# Altium schematic sheet sDAC_filters_0.SchDoc
size A; SheetNumber: 21; SheetTotal: 24
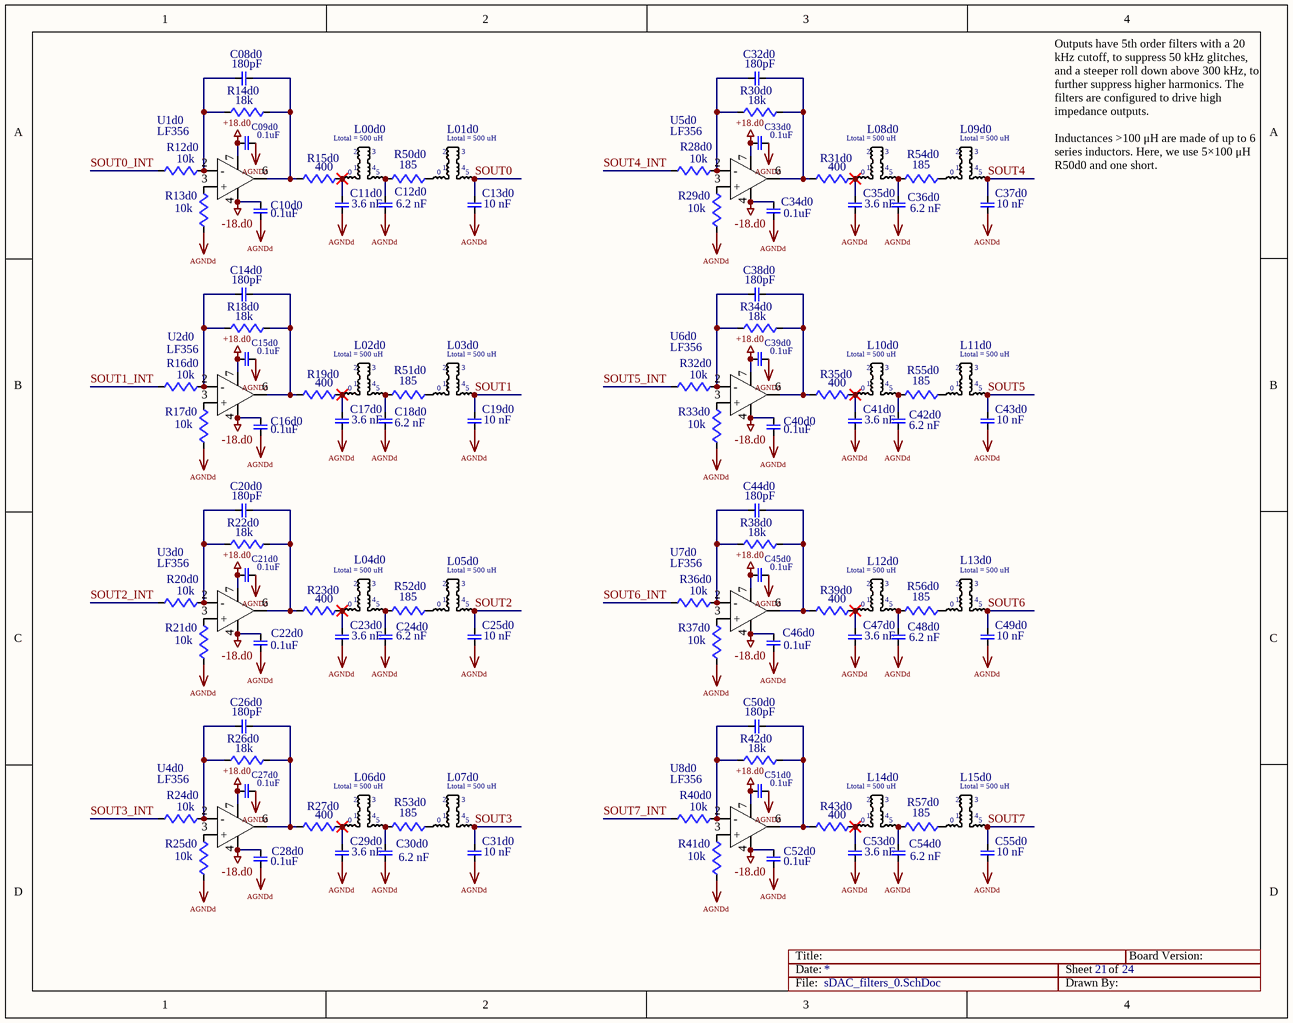
[diagram p0: sDAC_filters_0.SchDoc]

## Parts
C08d0  180pF  [0603]
C09d0  0.1uF  [0603]
C10d0  0.1uF  [0603]
C11d0  3.6 nF  [0603]
C12d0  6.2 nF  [0603]
C13d0  10 nF  [0603]
C14d0  180pF  [0603]
C15d0  0.1uF  [0603]
C16d0  0.1uF  [0603]
C17d0  3.6 nF  [0603]
C18d0  6.2 nF  [0603]
C19d0  10 nF  [0603]
C20d0  180pF  [0603]
C21d0  0.1uF  [0603]
C22d0  0.1uF  [0603]
C23d0  3.6 nF  [0603]
C24d0  6.2 nF  [0603]
C25d0  10 nF  [0603]
C26d0  180pF  [0603]
C27d0  0.1uF  [0603]
C28d0  0.1uF  [0603]
C29d0  3.6 nF  [0603]
C30d0  6.2 nF  [0603]
C31d0  10 nF  [0603]
C32d0  180pF  [0603]
C33d0  0.1uF  [0603]
C34d0  0.1uF  [0603]
C35d0  3.6 nF  [0603]
C36d0  6.2 nF  [0603]
C37d0  10 nF  [0603]
C38d0  180pF  [0603]
C39d0  0.1uF  [0603]
C40d0  0.1uF  [0603]
C41d0  3.6 nF  [0603]
C42d0  6.2 nF  [0603]
C43d0  10 nF  [0603]
C44d0  180pF  [0603]
C45d0  0.1uF  [0603]
C46d0  0.1uF  [0603]
C47d0  3.6 nF  [0603]
C48d0  6.2 nF  [0603]
C49d0  10 nF  [0603]
C50d0  180pF  [0603]
C51d0  0.1uF  [0603]
C52d0  0.1uF  [0603]
C53d0  3.6 nF  [0603]
C54d0  6.2 nF  [0603]
C55d0  10 nF  [0603]
L00d0  Ltotal = 500 uH  [SMT_TOROID_2SIDE]
L01d0  Ltotal = 500 uH  [SMT_TOROID_2SIDE]
L02d0  Ltotal = 500 uH  [SMT_TOROID_2SIDE]
L03d0  Ltotal = 500 uH  [SMT_TOROID_2SIDE]
L04d0  Ltotal = 500 uH  [SMT_TOROID_2SIDE]
L05d0  Ltotal = 500 uH  [SMT_TOROID_2SIDE]
L06d0  Ltotal = 500 uH  [SMT_TOROID_2SIDE]
L07d0  Ltotal = 500 uH  [SMT_TOROID_2SIDE]
L08d0  Ltotal = 500 uH  [SMT_TOROID_2SIDE]
L09d0  Ltotal = 500 uH  [SMT_TOROID_2SIDE]
L10d0  Ltotal = 500 uH  [SMT_TOROID_2SIDE]
L11d0  Ltotal = 500 uH  [SMT_TOROID_2SIDE]
L12d0  Ltotal = 500 uH  [SMT_TOROID_2SIDE]
L13d0  Ltotal = 500 uH  [SMT_TOROID_2SIDE]
L14d0  Ltotal = 500 uH  [SMT_TOROID_2SIDE]
L15d0  Ltotal = 500 uH  [SMT_TOROID_2SIDE]
R12d0  10k  [0603]
R13d0  10k  [0603]
R14d0  18k  [0603]
R15d0  400  [0603]
R16d0  10k  [0603]
R17d0  10k  [0603]
R18d0  18k  [0603]
R19d0  400  [0603]
R20d0  10k  [0603]
R21d0  10k  [0603]
R22d0  18k  [0603]
R23d0  400  [0603]
R24d0  10k  [0603]
R25d0  10k  [0603]
R26d0  18k  [0603]
R27d0  400  [0603]
R28d0  10k  [0603]
R29d0  10k  [0603]
R30d0  18k  [0603]
R31d0  400  [0603]
R32d0  10k  [0603]
R33d0  10k  [0603]
R34d0  18k  [0603]
R35d0  400  [0603]
R36d0  10k  [0603]
R37d0  10k  [0603]
R38d0  18k  [0603]
R39d0  400  [0603]
R40d0  10k  [0603]
R41d0  10k  [0603]
R42d0  18k  [0603]
R43d0  400  [0603]
R50d0  185  [0603]
R51d0  185  [0603]
R52d0  185  [0603]
R53d0  185  [0603]
R54d0  185  [0603]
R55d0  185  [0603]
R56d0  185  [0603]
R57d0  185  [0603]
U1d0  LF356  [8SOIC]
U2d0  LF356  [8SOIC]
U3d0  LF356  [8SOIC]
U4d0  LF356  [8SOIC]
U5d0  LF356  [8SOIC]
U6d0  LF356  [8SOIC]
U7d0  LF356  [8SOIC]
U8d0  LF356  [8SOIC]

## Nets
+18.d0: C09d0.1 C15d0.1 C21d0.1 C27d0.1 C33d0.1 C39d0.1 C45d0.1 C51d0.1 U1d0.7(V+) U2d0.7(V+) U3d0.7(V+) U4d0.7(V+) U5d0.7(V+) U6d0.7(V+) U7d0.7(V+) U8d0.7(V+)
-18.d0: C10d0.1 C16d0.1 C22d0.1 C28d0.1 C34d0.1 C40d0.1 C46d0.1 C52d0.1 U1d0.4(V-) U2d0.4(V-) U3d0.4(V-) U4d0.4(V-) U5d0.4(V-) U6d0.4(V-) U7d0.4(V-) U8d0.4(V-)
AGNDd: C09d0.2 C10d0.2 C11d0.2 C12d0.2 C13d0.2 C15d0.2 C16d0.2 C17d0.2 C18d0.2 C19d0.2 C21d0.2 C22d0.2 C23d0.2 C24d0.2 C25d0.2 C27d0.2 C28d0.2 C29d0.2 C30d0.2 C31d0.2 C33d0.2 C34d0.2 C35d0.2 C36d0.2 C37d0.2 C39d0.2 C40d0.2 C41d0.2 C42d0.2 C43d0.2 C45d0.2 C46d0.2 C47d0.2 C48d0.2 C49d0.2 C51d0.2 C52d0.2 C53d0.2 C54d0.2 C55d0.2 R13d0.1 R17d0.1 R21d0.1 R25d0.1 R29d0.1 R33d0.1 R37d0.1 R41d0.1
SOUT0: C13d0.1 L01d0.7
SOUT0_INT: R12d0.1
SOUT1: C19d0.1 L03d0.7
SOUT1_INT: R16d0.1
SOUT2: C25d0.1 L05d0.7
SOUT2_INT: R20d0.1
SOUT3: C31d0.1 L07d0.7
SOUT3_INT: R24d0.1
SOUT4: C37d0.1 L09d0.7
SOUT4_INT: R28d0.1
SOUT5: C43d0.1 L11d0.7
SOUT5_INT: R32d0.1
SOUT6: C49d0.1 L13d0.7
SOUT6_INT: R36d0.1
SOUT7: C55d0.1 L15d0.7
SOUT7_INT: R40d0.1
NetC08d0_1: C08d0.1 R14d0.2 R15d0.1 U1d0.6(OUT)
NetC08d0_2: C08d0.2 R12d0.2 R14d0.1 U1d0.2(-)
NetC11d0_1: C11d0.1 L00d0.1 R15d0.2
NetC12d0_1: C12d0.1 L00d0.7 R50d0.1
NetC14d0_1: C14d0.1 R18d0.2 R19d0.1 U2d0.6(OUT)
NetC14d0_2: C14d0.2 R16d0.2 R18d0.1 U2d0.2(-)
NetC17d0_1: C17d0.1 L02d0.1 R19d0.2
NetC18d0_1: C18d0.1 L02d0.7 R51d0.1
NetC20d0_1: C20d0.1 R22d0.2 R23d0.1 U3d0.6(OUT)
NetC20d0_2: C20d0.2 R20d0.2 R22d0.1 U3d0.2(-)
NetC23d0_1: C23d0.1 L04d0.1 R23d0.2
NetC24d0_1: C24d0.1 L04d0.7 R52d0.1
NetC26d0_1: C26d0.1 R26d0.2 R27d0.1 U4d0.6(OUT)
NetC26d0_2: C26d0.2 R24d0.2 R26d0.1 U4d0.2(-)
NetC29d0_1: C29d0.1 L06d0.1 R27d0.2
NetC30d0_1: C30d0.1 L06d0.7 R53d0.1
NetC32d0_1: C32d0.1 R30d0.2 R31d0.1 U5d0.6(OUT)
NetC32d0_2: C32d0.2 R28d0.2 R30d0.1 U5d0.2(-)
NetC35d0_1: C35d0.1 L08d0.1 R31d0.2
NetC36d0_1: C36d0.1 L08d0.7 R54d0.1
NetC38d0_1: C38d0.1 R34d0.2 R35d0.1 U6d0.6(OUT)
NetC38d0_2: C38d0.2 R32d0.2 R34d0.1 U6d0.2(-)
NetC41d0_1: C41d0.1 L10d0.1 R35d0.2
NetC42d0_1: C42d0.1 L10d0.7 R55d0.1
NetC44d0_1: C44d0.1 R38d0.2 R39d0.1 U7d0.6(OUT)
NetC44d0_2: C44d0.2 R36d0.2 R38d0.1 U7d0.2(-)
NetC47d0_1: C47d0.1 L12d0.1 R39d0.2
NetC48d0_1: C48d0.1 L12d0.7 R56d0.1
NetC50d0_1: C50d0.1 R42d0.2 R43d0.1 U8d0.6(OUT)
NetC50d0_2: C50d0.2 R40d0.2 R42d0.1 U8d0.2(-)
NetC53d0_1: C53d0.1 L14d0.1 R43d0.2
NetC54d0_1: C54d0.1 L14d0.7 R57d0.1
NetL01d0_1: L01d0.1 R50d0.2
NetL03d0_1: L03d0.1 R51d0.2
NetL05d0_1: L05d0.1 R52d0.2
NetL07d0_1: L07d0.1 R53d0.2
NetL09d0_1: L09d0.1 R54d0.2
NetL11d0_1: L11d0.1 R55d0.2
NetL13d0_1: L13d0.1 R56d0.2
NetL15d0_1: L15d0.1 R57d0.2
NetR13d0_2: R13d0.2 U1d0.3(+)
NetR17d0_2: R17d0.2 U2d0.3(+)
NetR21d0_2: R21d0.2 U3d0.3(+)
NetR25d0_2: R25d0.2 U4d0.3(+)
NetR29d0_2: R29d0.2 U5d0.3(+)
NetR33d0_2: R33d0.2 U6d0.3(+)
NetR37d0_2: R37d0.2 U7d0.3(+)
NetR41d0_2: R41d0.2 U8d0.3(+)

Not connected (* = marked no-connect by the designer): L00d0 2 3 4 5 6; L01d0 2 3 4 5 6; L02d0 2 3 4 5 6; L03d0 2 3 4 5 6; L04d0 2 3 4 5 6; L05d0 2 3 4 5 6; L06d0 2 3 4 5 6; L07d0 2 3 4 5 6; L08d0 2 3 4 5 6; L09d0 2 3 4 5 6; L10d0 2 3 4 5 6; L11d0 2 3 4 5 6; L12d0 2 3 4 5 6; L13d0 2 3 4 5 6; L14d0 2 3 4 5 6; L15d0 2 3 4 5 6

## Notes on the sheet
- Outputs have 5th order filters with a 20 kHz cutoff, to suppress 50 kHz glitches, and a steeper roll down above 300 kHz, to further suppress higher harmonics. The filters are configured to drive high impedance outputs.
  Inductances >100 μH are made of up to 6 series inductors. Here, we use 5×100 μH R50d0 and one short.
- Title:
- Date:
- Sheet
- of
- Board Version:
- File:
- Drawn By:
- Title
- Size:
- A3
- Number:
- Time:
- Revision:
- (in symbol SMT_TOROID_2SIDE) 0

## Library data of the parts
C08d0 C09d0 C10d0 C11d0 C12d0 C13d0 C14d0 C15d0 C16d0 C17d0 C18d0 C19d0 C20d0 C21d0 C22d0 C23d0 C24d0 C25d0 C26d0 C27d0 C28d0 C29d0 C30d0 C31d0 C32d0 C33d0 C34d0 C35d0 C36d0 C37d0 C38d0 C39d0 C40d0 C41d0 C42d0 C43d0 C44d0 C45d0 C46d0 C47d0 C48d0 C49d0 C50d0 C51d0 C52d0 C53d0 C54d0 C55d0 = CAP
L00d0 L01d0 L02d0 L03d0 L04d0 L05d0 L06d0 L07d0 L08d0 L09d0 L10d0 L11d0 L12d0 L13d0 L14d0 L15d0 = SMT_TOROID_2SIDE
R12d0 R13d0 R14d0 R15d0 R16d0 R17d0 R18d0 R19d0 R20d0 R21d0 R22d0 R23d0 R24d0 R25d0 R26d0 R27d0 R28d0 R29d0 R30d0 R31d0 R32d0 R33d0 R34d0 R35d0 R36d0 R37d0 R38d0 R39d0 R40d0 R41d0 R42d0 R43d0 R50d0 R51d0 R52d0 R53d0 R54d0 R55d0 R56d0 R57d0 = RES